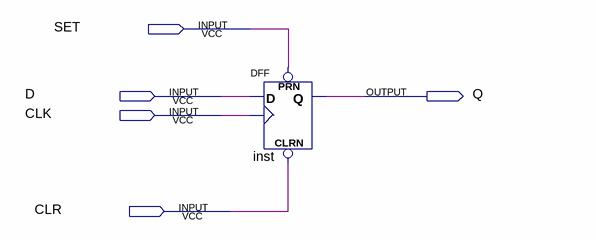
[diagram p0: schematic sheet]
// Quartus schematic DFLIPFLOP.bdf as structural Verilog: 1 symbols, 5 pins
module DFLIPFLOP (
  input  SET,
  input  D,
  input  CLK,
  input  CLR,
  output Q
);

  DFF inst (.CLRN(CLR), .CLK(CLK), .D(D), .PRN(SET), .Q(Q));
endmodule
